# Altium schematic sheet Buck_TPSM843321_9V0.SchDoc
size A; SheetNumber: 8; SheetTotal: 17
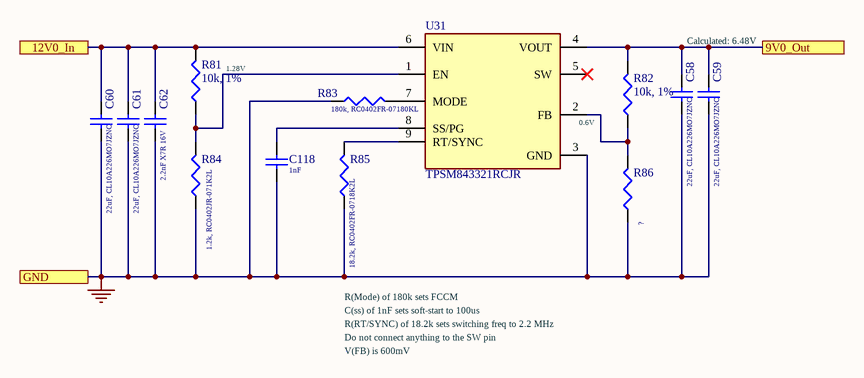
[diagram p0: Buck_TPSM843321_9V0.SchDoc]

## Parts
C58  22uF, CL10A226MO7JZNC  [SMD-0603]
C59  22uF, CL10A226MO7JZNC  [SMD-0603]
C60  22uF, CL10A226MO7JZNC  [SMD-0603]
C61  22uF, CL10A226MO7JZNC  [SMD-0603]
C62  2.2nF X7R 16V  [SMD-0402]
C118  1nF  [SMD-0402]
R81  10k, 1%  [SMD-0402]
R82  10k, 1%  [SMD-0402]
R83  180k, RC0402FR-07180KL  [SMD-0402]
R84  1.2k, RC0402JR-071K2L  [SMD-0402]
R85  18.2k, RC0402FR-0718K2L  [SMD-0402]
R86  ?  [SMD-0402]
U31  TPSM843321RCJR  [TPSM843321RCJR]

## Ports
9V0_Out, 12V0_In, GND

## Nets
GND: C58.1 C59.1 C60.1 C61.1 C62.1 C118.2 R83.1 R84.1 R85.1 R86.1 U31.3(GND) ; port GND
9V0_Out: C58.2 C59.2 R82.2 U31.4(VOUT) ; port 9V0_Out
12V0_In: C60.2 C61.2 C62.2 R81.2 U31.6(VIN) ; port 12V0_In
NetC118_1: C118.1 U31.8(SS/PG)
NetR81_1: R81.1 R84.2 U31.1(EN)
NetR82_1: R82.1 R86.2 U31.2(FB)
NetR83_2: R83.2 U31.7(MODE)
NetR85_2: R85.2 U31.9(RT/SYNC)

Not connected (* = marked no-connect by the designer): U31 5(SW)*

## Notes on the sheet
- Calculated: 6.48V
- (near R81) 1.28V
- (near U31) 0.6V
- R(RT/SYNC) of 18.2k sets switching freq to 2.2 MHz
- R(Mode) of 180k sets FCCM
- C(ss) of 1nF sets soft-start to 100us
- Do not connect anything to the SW pin
- V(FB) is 600mV

## Library data of the parts
C58-C61 = CAP0603: Ceramic Capacitor 0603
C62 C118 = CAP0402: Ceramic Capacitor 0402
R81-R86 = RES0402: Resistor-0402
U31 = TPSM843321RCJR: Non-Isolated PoL Module DC DC Converter 1 Output 5V 3A 3.8V - 18V Input; MF: Texas Instruments; SnapEDA_Link: https://www.snapeda.com/parts/TPSM843321RCJR/Texas+Instruments/view-part/?ref=snap; Package: None; Value: *; MP: TPSM843321RCJR; Check_prices: https://www.snapeda.com/parts/TPSM843321RCJR/Texas+Instruments/view-part/?ref=eda